# EAGLE design led_parallel_strip_v1 (EAGLE 6.5.0)
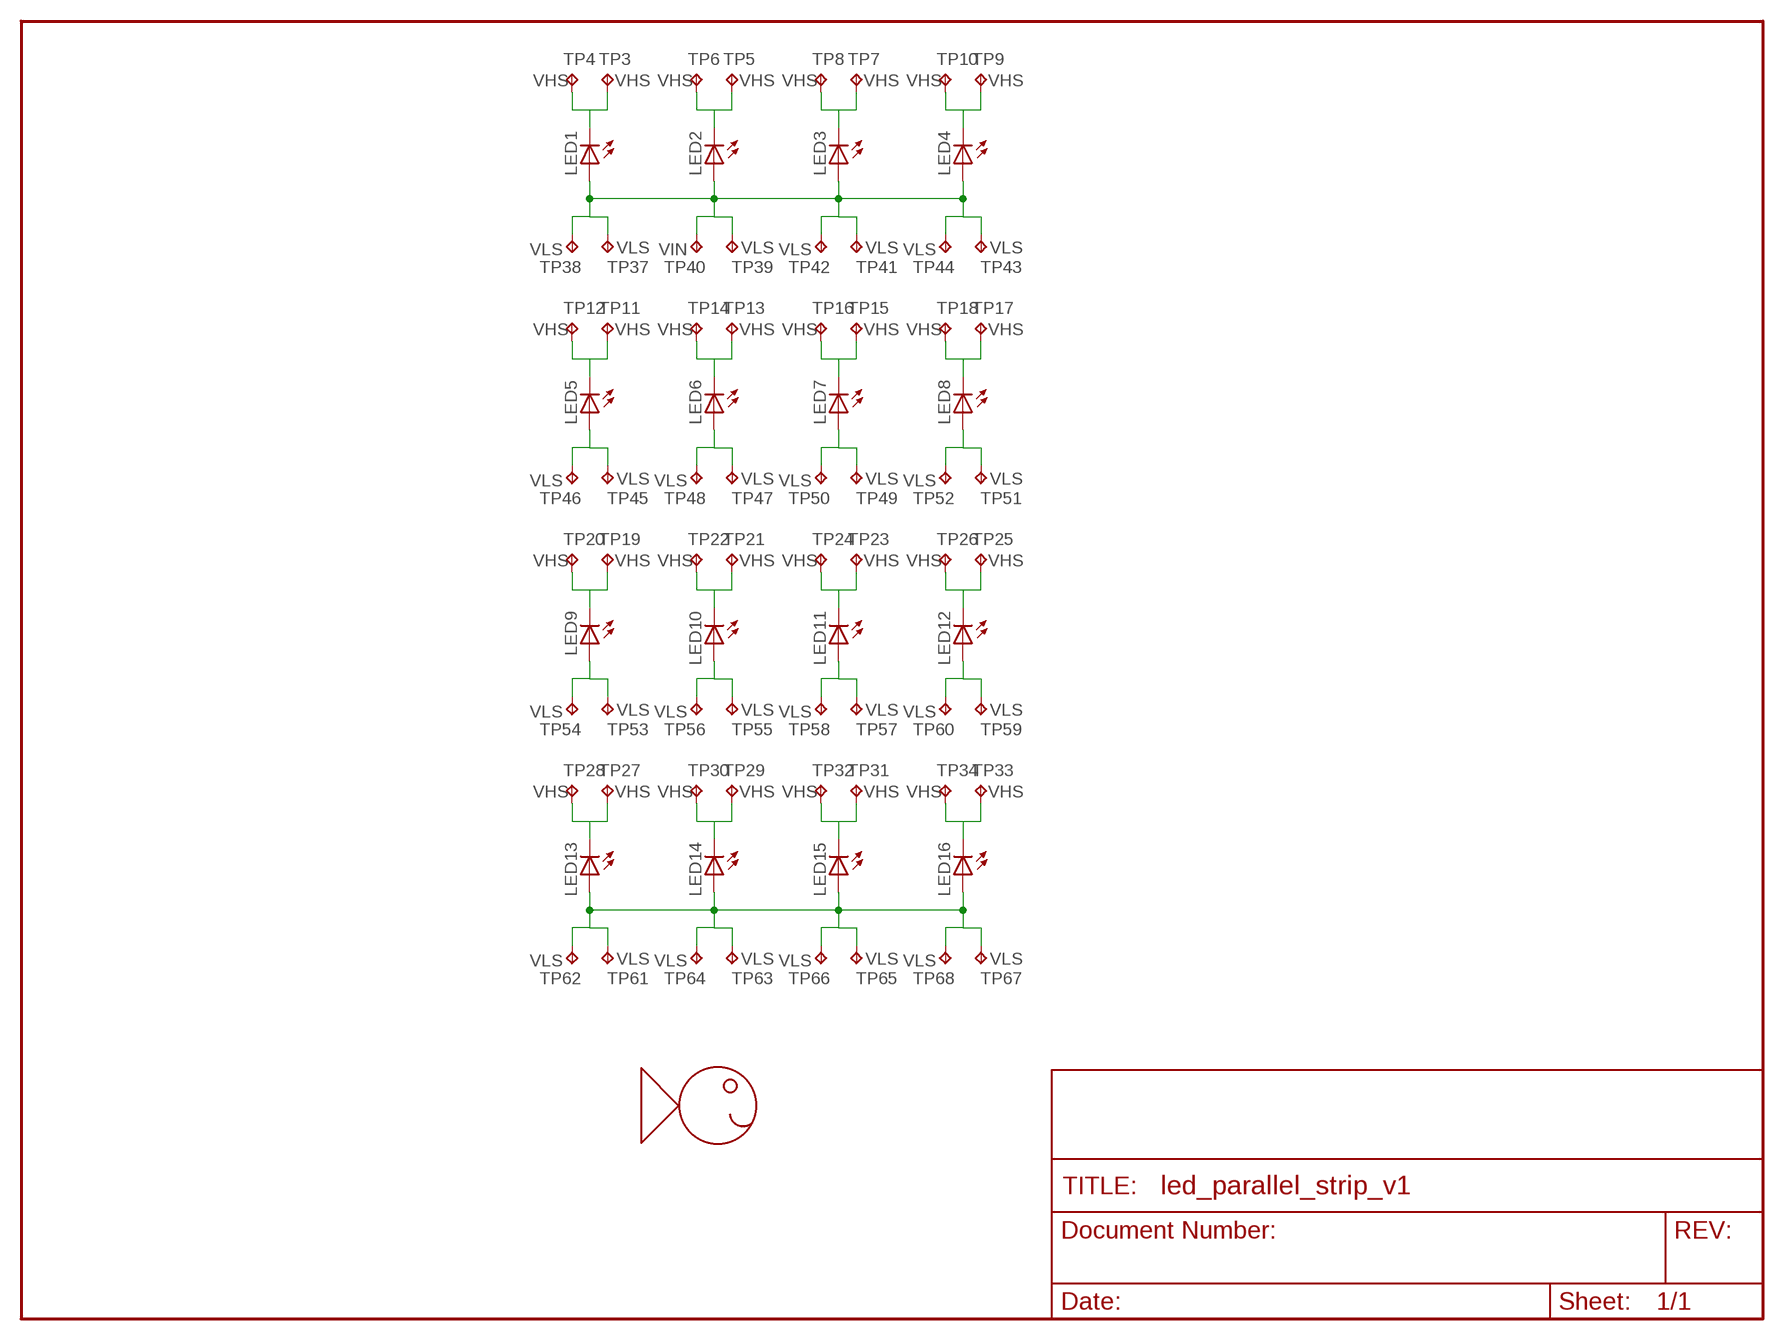
[diagram p0: schematic, sheet 1]

## Parts
LED1  LED0805  [LED_0805]
LED2  LED0805  [LED_0805]
LED3  LED0805  [LED_0805]
LED4  LED0805  [LED_0805]
LED5  LED0805  [LED_0805]
LED6  LED0805  [LED_0805]
LED7  LED0805  [LED_0805]
LED8  LED0805  [LED_0805]
LED9  LED0805  [LED_0805]
LED10  LED0805  [LED_0805]
LED11  LED0805  [LED_0805]
LED12  LED0805  [LED_0805]
LED13  LED0805  [LED_0805]
LED14  LED0805  [LED_0805]
LED15  LED0805  [LED_0805]
LED16  LED0805  [LED_0805]
TP3  VHS  TEST_POINTPAD1-20  [P1-20]
TP4  VHS  TEST_POINTPAD1-20  [P1-20]
TP5  VHS  TEST_POINTPAD1-20  [P1-20]
TP6  VHS  TEST_POINTPAD1-20  [P1-20]
TP7  VHS  TEST_POINTPAD1-20  [P1-20]
TP8  VHS  TEST_POINTPAD1-20  [P1-20]
TP9  VHS  TEST_POINTPAD1-20  [P1-20]
TP10  VHS  TEST_POINTPAD1-20  [P1-20]
TP11  VHS  TEST_POINTPAD1-20  [P1-20]
TP12  VHS  TEST_POINTPAD1-20  [P1-20]
TP13  VHS  TEST_POINTPAD1-20  [P1-20]
TP14  VHS  TEST_POINTPAD1-20  [P1-20]
TP15  VHS  TEST_POINTPAD1-20  [P1-20]
TP16  VHS  TEST_POINTPAD1-20  [P1-20]
TP17  VHS  TEST_POINTPAD1-20  [P1-20]
TP18  VHS  TEST_POINTPAD1-20  [P1-20]
TP19  VHS  TEST_POINTPAD1-20  [P1-20]
TP20  VHS  TEST_POINTPAD1-20  [P1-20]
TP21  VHS  TEST_POINTPAD1-20  [P1-20]
TP22  VHS  TEST_POINTPAD1-20  [P1-20]
TP23  VHS  TEST_POINTPAD1-20  [P1-20]
TP24  VHS  TEST_POINTPAD1-20  [P1-20]
TP25  VHS  TEST_POINTPAD1-20  [P1-20]
TP26  VHS  TEST_POINTPAD1-20  [P1-20]
TP27  VHS  TEST_POINTPAD1-20  [P1-20]
TP28  VHS  TEST_POINTPAD1-20  [P1-20]
TP29  VHS  TEST_POINTPAD1-20  [P1-20]
TP30  VHS  TEST_POINTPAD1-20  [P1-20]
TP31  VHS  TEST_POINTPAD1-20  [P1-20]
TP32  VHS  TEST_POINTPAD1-20  [P1-20]
TP33  VHS  TEST_POINTPAD1-20  [P1-20]
TP34  VHS  TEST_POINTPAD1-20  [P1-20]
TP37  VLS  TEST_POINTPAD1-20  [P1-20]
TP38  VLS  TEST_POINTPAD1-20  [P1-20]
TP39  VLS  TEST_POINTPAD1-20  [P1-20]
TP40  VIN  TEST_POINTPAD1-20  [P1-20]
TP41  VLS  TEST_POINTPAD1-20  [P1-20]
TP42  VLS  TEST_POINTPAD1-20  [P1-20]
TP43  VLS  TEST_POINTPAD1-20  [P1-20]
TP44  VLS  TEST_POINTPAD1-20  [P1-20]
TP45  VLS  TEST_POINTPAD1-20  [P1-20]
TP46  VLS  TEST_POINTPAD1-20  [P1-20]
TP47  VLS  TEST_POINTPAD1-20  [P1-20]
TP48  VLS  TEST_POINTPAD1-20  [P1-20]
TP49  VLS  TEST_POINTPAD1-20  [P1-20]
TP50  VLS  TEST_POINTPAD1-20  [P1-20]
TP51  VLS  TEST_POINTPAD1-20  [P1-20]
TP52  VLS  TEST_POINTPAD1-20  [P1-20]
TP53  VLS  TEST_POINTPAD1-20  [P1-20]
TP54  VLS  TEST_POINTPAD1-20  [P1-20]
TP55  VLS  TEST_POINTPAD1-20  [P1-20]
TP56  VLS  TEST_POINTPAD1-20  [P1-20]
TP57  VLS  TEST_POINTPAD1-20  [P1-20]
TP58  VLS  TEST_POINTPAD1-20  [P1-20]
TP59  VLS  TEST_POINTPAD1-20  [P1-20]
TP60  VLS  TEST_POINTPAD1-20  [P1-20]
TP61  VLS  TEST_POINTPAD1-20  [P1-20]
TP62  VLS  TEST_POINTPAD1-20  [P1-20]
TP63  VLS  TEST_POINTPAD1-20  [P1-20]
TP64  VLS  TEST_POINTPAD1-20  [P1-20]
TP65  VLS  TEST_POINTPAD1-20  [P1-20]
TP66  VLS  TEST_POINTPAD1-20  [P1-20]
TP67  VLS  TEST_POINTPAD1-20  [P1-20]
TP68  VLS  TEST_POINTPAD1-20  [P1-20]
U$1  FHI_LOGO  [FHI_LOGO]

## Nets
VHS1: LED1.C TP3.TP TP4.TP
VHS2: LED2.C TP5.TP TP6.TP
VHS3: LED3.C TP7.TP TP8.TP
VHS4: LED4.C TP9.TP TP10.TP
VHS5: LED5.C TP11.TP TP12.TP
VHS6: LED6.C TP13.TP TP14.TP
VHS7: LED7.C TP15.TP TP16.TP
VHS8: LED8.C TP17.TP TP18.TP
VHS9: LED9.C TP19.TP TP20.TP
VHS10: LED10.C TP21.TP TP22.TP
VHS11: LED11.C TP23.TP TP24.TP
VHS12: LED12.C TP25.TP TP26.TP
VHS13: LED13.C TP27.TP TP28.TP
VHS14: LED14.C TP29.TP TP30.TP
VHS15: LED15.C TP31.TP TP32.TP
VHS16: LED16.C TP33.TP TP34.TP
VLS: LED1.A LED2.A LED3.A LED4.A LED5.A LED6.A LED7.A LED8.A LED9.A LED10.A LED11.A LED12.A LED13.A LED14.A LED15.A LED16.A TP37.TP TP38.TP TP39.TP TP40.TP TP41.TP TP42.TP TP43.TP TP44.TP TP45.TP TP46.TP TP47.TP TP48.TP TP49.TP TP50.TP TP51.TP TP52.TP TP53.TP TP54.TP TP55.TP TP56.TP TP57.TP TP58.TP TP59.TP TP60.TP TP61.TP TP62.TP TP63.TP TP64.TP TP65.TP TP66.TP TP67.TP TP68.TP

## Library data of the parts
LED1-LED16 = CyberRailGuru:LED: LEDs Standard schematic elements and footprints for 5mm, 3mm, 1206, and 0603 sized LEDs. 5mm - Spark Fun Electronics SKU : COM-00529 (and others)
TP3-TP34 TP37-TP68 = CyberRailGuru:TEST_POINT: Test pad
U$1 = CyberRailGuru:FHI_LOGO: Fishhead Industries Logo

## Board
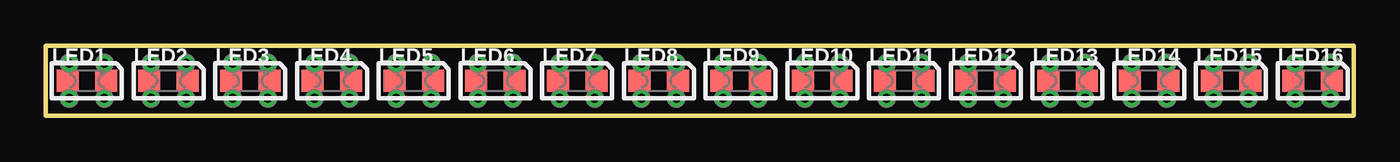
[diagram p1: board, top side]
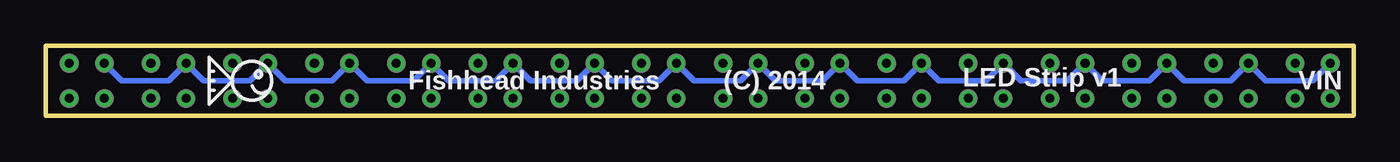
[diagram p2: board, bottom side, seen from below]

Size 71.12 x 3.8 mm. Coordinates in mm from the lower left corner, seen from the top.
Outline: 0,0 71.12,0 71.12,3.8 0,3.8 0,0
Copper layers (1*16): Top 0.035mm / dielectric 1.5mm / Bottom 0.035mm
Design rules "Fusion_eagle_rule_v1.1_tms *": minimum track width 6mil, minimum drill 12mil, track to track 6mil, track to pad 6mil, pad to pad 6mil, via to via 6mil, smd to smd 0mil, copper to edge 10mil, drill to drill 10mil, minimum pad ring 10mil, minimum via ring 6mil, stop-mask expansion 2mil, vias tented up to drill 100mil, thermal gap 10mil

### Footprints (pad centres in the part's own frame; a part is rotated, then mirrored left to right if it is on the bottom)
LED_0805 = smd 1.2 x 1.2: A 0,-1.05; C 0,1.05
P1-20 = drill 0.5: TP 0,0

### Placement (x,y rotation side)
LED1  2.22,1.91 270 top
LED2  6.67,1.91 270 top
LED3  11.11,1.91 270 top
LED4  15.56,1.91 270 top
LED5  20,1.91 270 top
LED6  24.45,1.91 270 top
LED7  28.89,1.91 270 top
LED8  33.34,1.91 270 top
LED9  37.78,1.91 270 top
LED10  42.23,1.91 270 top
LED11  46.67,1.91 270 top
LED12  51.12,1.91 270 top
LED13  55.56,1.91 270 top
LED14  60.01,1.91 270 top
LED15  64.45,1.91 270 top
LED16  68.9,1.91 270 top
TP3  3.17,2.86 0 top
TP4  3.17,0.95 0 top
TP5  7.62,2.86 0 top
TP6  7.62,0.95 0 top
TP7  12.06,2.86 0 top
TP8  12.06,0.95 0 top
TP9  16.51,2.86 0 top
TP10  16.51,0.95 0 top
TP11  20.95,2.86 0 top
TP12  20.95,0.95 0 top
TP13  25.4,2.86 0 top
TP14  25.4,0.95 0 top
TP15  29.84,2.86 0 top
TP16  29.84,0.95 0 top
TP17  34.29,2.86 90 top
TP18  34.29,0.95 90 top
TP19  38.73,2.86 90 top
TP20  38.73,0.95 90 top
TP21  43.18,2.86 90 top
TP22  43.18,0.95 90 top
TP23  47.62,2.86 90 top
TP24  47.62,0.95 90 top
TP25  52.07,2.86 90 top
TP26  52.07,0.95 90 top
TP27  56.52,2.86 90 top
TP28  56.52,0.95 90 top
TP29  60.96,2.86 90 top
TP30  60.96,0.95 90 top
TP31  65.41,2.86 90 top
TP32  65.41,0.95 90 top
TP33  69.85,2.86 90 top
TP34  69.85,0.95 90 top
TP37  1.27,2.86 90 top
TP38  1.27,0.95 0 top
TP39  5.71,2.86 90 top
TP40  5.71,0.95 90 top
TP41  10.16,2.86 90 top
TP42  10.16,0.95 90 top
TP43  14.61,2.86 90 top
TP44  14.61,0.95 90 top
TP45  19.05,2.86 90 top
TP46  19.05,0.95 90 top
TP47  23.5,2.86 90 top
TP48  23.5,0.95 90 top
TP49  27.94,2.86 90 top
TP50  27.94,0.95 90 top
TP51  32.38,2.86 90 top
TP52  32.38,0.95 90 top
TP53  36.83,2.86 90 top
TP54  36.83,0.95 90 top
TP55  41.27,2.86 90 top
TP56  41.27,0.95 90 top
TP57  45.72,2.86 90 top
TP58  45.72,0.95 90 top
TP59  50.16,2.86 90 top
TP60  50.16,0.95 90 top
TP61  54.61,2.86 90 top
TP62  54.61,0.95 90 top
TP63  59.05,2.86 90 top
TP64  59.05,0.95 90 top
TP65  63.5,2.86 90 top
TP66  63.5,0.95 90 top
TP67  67.94,2.86 90 top
TP68  67.94,0.95 90 top
U$1  60.96,1.91 0 bottom

### Tracks (layer width: path | path; a pad name or v marks a point on that pad's centre or on a via)
VHS1
  Top 0.305: TP3.TP 3.27,2.76 LED1.C 3.27,1.05 TP4.TP
VHS2
  Top 0.305: TP5.TP 7.72,2.76 LED2.C 7.72,1.05 TP6.TP
VHS3
  Top 0.305: TP7.TP 12.16,2.76 LED3.C 12.16,1.05 TP8.TP
VHS4
  Top 0.305: TP9.TP 16.61,2.76 LED4.C 16.61,1.05 TP10.TP
VHS5
  Top 0.305: TP11.TP 21.05,2.76 LED5.C 21.05,1.05 TP12.TP
VHS6
  Top 0.305: TP13.TP 25.5,2.76 LED6.C 25.5,1.05 TP14.TP
VHS7
  Top 0.305: TP15.TP 29.94,2.76 LED7.C 29.94,1.05 TP16.TP
VHS8
  Top 0.305: TP17.TP 34.39,2.76 LED8.C 34.39,1.05 TP18.TP
VHS9
  Top 0.305: TP19.TP 38.83,2.76 LED9.C 38.83,1.05 TP20.TP
VHS10
  Top 0.305: TP21.TP 43.28,2.76 LED10.C 43.28,1.05 TP22.TP
VHS11
  Top 0.305: TP23.TP 47.72,2.76 LED11.C 47.72,1.05 TP24.TP
VHS12
  Top 0.305: TP25.TP 52.17,2.76 LED12.C 52.17,1.05 TP26.TP
VHS13
  Top 0.305: TP27.TP 56.61,2.76 LED13.C 56.61,1.05 TP28.TP
VHS14
  Top 0.305: TP29.TP 61.06,2.76 LED14.C 61.06,1.05 TP30.TP
VHS15
  Top 0.305: TP32.TP 65.5,1.05 LED15.C 65.5,2.76 TP31.TP
VHS16
  Top 0.305: TP33.TP 69.95,2.76 LED16.C 69.95,1.05 TP34.TP
VLS
  Top 0.305: TP37.TP 1.11,2.7 1.11,1.97 LED1.A 1.17,1.05 TP38.TP | TP39.TP 5.62,2.76 LED2.A 5.62,1.05 TP40.TP | TP41.TP 10.06,2.76 LED3.A 10.06,1.05 TP42.TP | TP43.TP 14.51,2.76 LED4.A 14.51,1.05 TP44.TP | TP45.TP 18.95,2.76 LED5.A 18.95,1.05 TP46.TP | TP47.TP 23.4,2.76 LED6.A 23.4,1.05 TP48.TP | TP49.TP 27.84,2.76 LED7.A 27.84,1.05 TP50.TP | TP51.TP 32.29,2.76 LED8.A 32.29,1.05 TP52.TP | TP53.TP 36.73,2.76 LED9.A 36.73,1.05 TP54.TP | TP55.TP 41.18,2.76 LED10.A 41.18,1.05 TP56.TP | TP57.TP 45.62,2.76 LED11.A 45.62,1.05 TP58.TP | TP59.TP 50.07,2.76 LED12.A 50.07,1.05 TP60.TP | TP61.TP 54.51,2.76 LED13.A 54.51,1.05 TP62.TP | TP63.TP 58.96,2.76 LED14.A 58.96,1.05 TP64.TP | TP65.TP 63.4,2.76 LED15.A 63.4,1.05 TP66.TP | TP67.TP 67.85,2.76 LED16.A 67.85,1.05 TP68.TP
  Bottom 0.305: TP67.TP 66.99,1.91 64.45,1.91 TP65.TP 62.55,1.91 60.01,1.91 TP63.TP 58.1,1.91 55.56,1.91 TP61.TP 53.66,1.91 51.12,1.91 TP59.TP 49.21,1.91 46.67,1.91 TP57.TP 44.77,1.91 42.23,1.91 TP55.TP 40.32,1.91 37.78,1.91 TP53.TP 35.88,1.91 33.34,1.91 TP51.TP 31.43,1.91 28.89,1.91 TP49.TP 26.99,1.91 24.45,1.91 TP47.TP 22.54,1.91 20,1.91 TP45.TP 18.1,1.91 15.56,1.91 TP43.TP 13.65,1.91 11.11,1.91 TP41.TP 9.21,1.91 6.67,1.91 TP39.TP 4.76,1.91 2.22,1.91 TP37.TP

### Text on the board
bPlace: LED Strip v1 | VIN | (C) 2014 | Fishhead Industries